# Altium schematic sheet Dust1_Motherboard_Peripheral.SchDoc
size A4; SheetNumber: 5; SheetTotal: 5
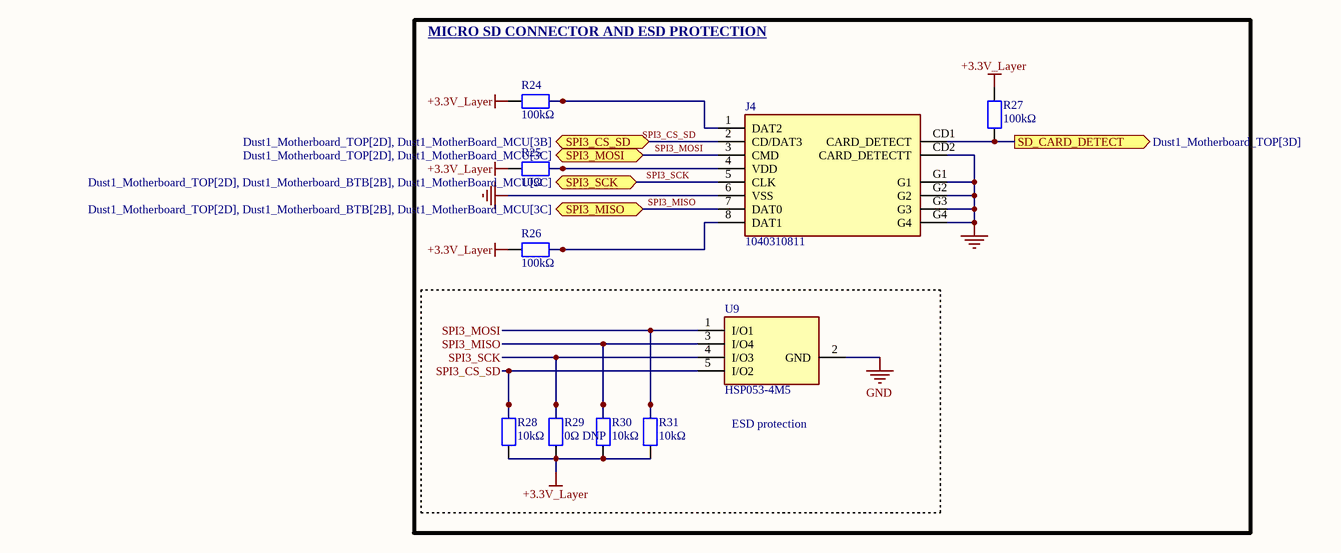
[diagram p0: Dust1_Motherboard_Peripheral.SchDoc]

## Parts
J4  1040310811  [1040310811]
R24  100kΩ  [RES_0402]
R25  10Ω  [RES_0402]
R26  100kΩ  [RES_0402]
R27  100kΩ  [RES_0402]
R28  10kΩ  [RES_0402]
R29  0Ω DNP  [RES_0402]
R30  10kΩ  [RES_0402]
R31  10kΩ  [RES_0402]
U9  HSP053-4M5  [HSP0534M5]

## Blocks framed on the sheet
MICRO SD CONNECTOR AND ESD PROTECTION: J4 R24-R27
ESD protection: R28-R31 U9

## Ports
SD_CARD_DETECT (out, see Dust1_Motherboard_TOP[3D]), SPI3_CS_SD (bidir, see Dust1_Motherboard_TOP[2D], Dust1_MotherBoard_MCU[3B]), SPI3_MISO (bidir, see Dust1_Motherboard_TOP[2D], Dust1_Motherboard_BTB[2B], Dust1_MotherBoard_MCU[3C]), SPI3_MOSI (bidir, see Dust1_Motherboard_TOP[2D], Dust1_MotherBoard_MCU[3C]), SPI3_SCK (bidir, see Dust1_Motherboard_TOP[2D], Dust1_Motherboard_BTB[2B], Dust1_MotherBoard_MCU[3C])

## Nets
+3.3V_Layer: R24.2 R25.2 R26.2 R27.2 R28.1 R29.1 R30.1 R31.1
GND: J4.6(VSS) J4.CD2(CARD_DETECTT) J4.G1 J4.G2 J4.G3 J4.G4 U9.2(GND)
SD_CARD_DETECT: J4.CD1(CARD_DETECT) R27.1 ; port SD_CARD_DETECT
SPI3_CS_SD: J4.2(CD/DAT3) R28.2 U9.5(I/O2) ; port SPI3_CS_SD
SPI3_MISO: J4.7(DAT0) R30.2 U9.3(I/O4) ; port SPI3_MISO
SPI3_MOSI: J4.3(CMD) R31.2 U9.1(I/O1) ; port SPI3_MOSI
SPI3_SCK: J4.5(CLK) R29.2 U9.4(I/O3) ; port SPI3_SCK
NetJ4_1: J4.1(DAT2) R24.1
NetJ4_4: J4.4(VDD) R25.1
NetJ4_8: J4.8(DAT1) R26.1

## Library data of the parts
J4 = CMP-002-00092-2: 1.10mm Pitch microSD Memory Card Connector, Surface Mount, Push-Pull Type, 1.42mm Height, with Detect Switch; Manufacturer_Name: Molex; Geometry.Height: 1.77mm; Manufacturer_Part_Number: 1040310811; Source: 1040310811.SchLib; Mouser Price/Stock: *; Arrow Price/Stock: https://www.arrow.com/en/products/1040310811/molex?utm_currency=USD&region=europe; Mouser Part Number: *; Design Item ID: 1040310811; Datasheet Link: https://www.molex.com/en-us/products/part-detail-pdf/1040310811?display=pdf; Arrow Part Number: 1040310811
R24-R31 = CMP-009-00192-1: Resistor SMD 0402 Generic; Design Item ID: RES_0402; Source: RES_0402.SchLib
U9 = CMP-004-00039-6: Clamp Ipp Tvs Diode Surface Mount 5-uQFN (1.3x0.8); Manufacturer_Name: STMicroelectronics; Geometry.Height: 0.4mm; Source: HSP053-4M5.SchLib; Design Item ID: HSP053-4M5; Mouser Price/Stock: https://www.mouser.co.uk/ProductDetail/STMicroelectronics/HSP053-4M5?qs=lYGu3FyN48c0CphNYEE2iw%3D%3D; Mouser Part Number: 511-HSP053-4M5; Datasheet Link: https://www.st.com/resource/en/datasheet/hsp051-4m5.pdf; Manufacturer_Part_Number: HSP053-4M5